# EAGLE design scematics (EAGLE 9.6.2)
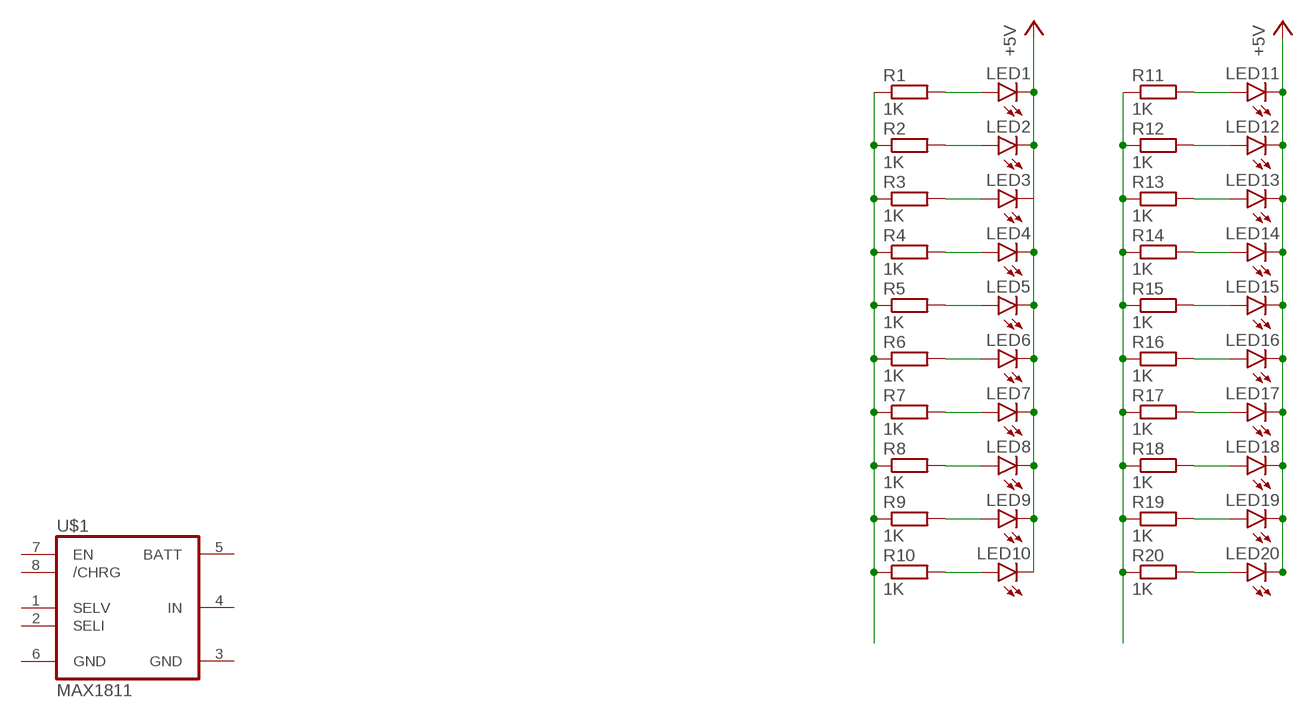
[diagram p0: schematic, sheet 1]

## Parts
LED1  LEDCHIPLED_0805  [CHIPLED_0805]
LED2  LEDCHIPLED_0805  [CHIPLED_0805]
LED3  LEDCHIPLED_0805  [CHIPLED_0805]
LED4  LEDCHIPLED_0805  [CHIPLED_0805]
LED5  LEDCHIPLED_0805  [CHIPLED_0805]
LED6  LEDCHIPLED_0805  [CHIPLED_0805]
LED7  LEDCHIPLED_0805  [CHIPLED_0805]
LED8  LEDCHIPLED_0805  [CHIPLED_0805]
LED9  LEDCHIPLED_0805  [CHIPLED_0805]
LED10  LEDCHIPLED_0805  [CHIPLED_0805]
LED11  LEDCHIPLED_0805  [CHIPLED_0805]
LED12  LEDCHIPLED_0805  [CHIPLED_0805]
LED13  LEDCHIPLED_0805  [CHIPLED_0805]
LED14  LEDCHIPLED_0805  [CHIPLED_0805]
LED15  LEDCHIPLED_0805  [CHIPLED_0805]
LED16  LEDCHIPLED_0805  [CHIPLED_0805]
LED17  LEDCHIPLED_0805  [CHIPLED_0805]
LED18  LEDCHIPLED_0805  [CHIPLED_0805]
LED19  LEDCHIPLED_0805  [CHIPLED_0805]
LED20  LEDCHIPLED_0805  [CHIPLED_0805]
R1  1K  R-EU_R0805  [R0805]
R2  1K  R-EU_R0805  [R0805]
R3  1K  R-EU_R0805  [R0805]
R4  1K  R-EU_R0805  [R0805]
R5  1K  R-EU_R0805  [R0805]
R6  1K  R-EU_R0805  [R0805]
R7  1K  R-EU_R0805  [R0805]
R8  1K  R-EU_R0805  [R0805]
R9  1K  R-EU_R0805  [R0805]
R10  1K  R-EU_R0805  [R0805]
R11  1K  R-EU_R0805  [R0805]
R12  1K  R-EU_R0805  [R0805]
R13  1K  R-EU_R0805  [R0805]
R14  1K  R-EU_R0805  [R0805]
R15  1K  R-EU_R0805  [R0805]
R16  1K  R-EU_R0805  [R0805]
R17  1K  R-EU_R0805  [R0805]
R18  1K  R-EU_R0805  [R0805]
R19  1K  R-EU_R0805  [R0805]
R20  1K  R-EU_R0805  [R0805]
U$1  MAX1811  [SO08]

## Nets
+5V: LED1.C LED2.C LED4.C LED5.C LED6.C LED7.C LED8.C LED9.C LED10.C LED11.C LED12.C LED13.C LED14.C LED15.C LED16.C LED17.C LED18.C LED19.C LED20.C
N$1: LED1.A R1.2
N$2: LED2.A R2.2
N$3: LED3.A R3.2
N$4: LED4.A R4.2
N$5: LED5.A R5.2
N$6: LED6.A R6.2
N$7: LED7.A R7.2
N$8: LED8.A R8.2
N$9: LED9.A R9.2
N$10: LED10.A R10.2
N$14: LED11.A R11.2
N$22: LED12.A R12.2
N$23: LED13.A R13.2
N$24: LED14.A R14.2
N$25: LED15.A R15.2
N$26: LED16.A R16.2
N$27: LED17.A R17.2
N$28: LED18.A R18.2
N$29: LED19.A R19.2
N$30: LED20.A R20.2
N$40: R1.1 R2.1 R3.1 R4.1 R5.1 R6.1 R7.1 R8.1 R9.1 R10.1
N$41: R11.1 R12.1 R13.1 R14.1 R15.1 R16.1 R17.1 R18.1 R19.1 R20.1
Unconnected: LED3.C U$1.1(SELV) U$1.2(SELI) U$1.5(BATT) U$1.7(EN) U$1.8(/CHRG)

## Power pins joined to a net without a drawn wire
GND: U$1.3(GND) U$1.6(GND)
IN: U$1.4(IN)

## Library data of the parts
LED1-LED20 = led:LED: LED OSRAM: - CHIPLED LG R971, LG N971, LY N971, LG Q971, LY Q971, LO R971, LY R971 LH N974, LH R974 LS Q976, LO Q976, LY Q976 LO Q996 - Hyper CHIPLED LW Q18S LB Q993, LB Q99A, LB R99A - SideLED LS A670, LO A670, LY A670, LG A670, LP A670 LB A673, LV A673, LT A673, LW A673 LH A674 LY A675 LS A676, LA A676, LO A676, LY A676, LW A676 LS A679, LY A679, LG A679 - Hyper Micro SIDELED® LS Y876, LA Y876, LO Y876, LY Y876 LT Y87S - SmartLED LW L88C, LW L88S LB L89C, LB L89S, LG L890 LS L89K, LO L89K, LY L89K LS L896, LA L896, LO L896, LY L896 - TOPLED LS T670, LO T670, LY T670, LG T670, LP T670 LSG T670, LSP T670, LSY T670, LOP T670, LYG T670 LG T671, LOG T671, LSG T671 LB T673, LV T673, LT T673, LW T673 LH T674 LS T676, LA T676, LO T676, LY T676, LB T676, LH T676, LSB T676, LW T676 LB T67C, LV T67C, LT T67C, LS T67K, LO T67K, LY T67K, LW E67C LS E67B, LA E67B, LO E67B, LY E67B, LB E67C, LV E67C, LT E67C LW T67C LS T679, LY T679, LG T679 LS T770, LO T770, LY T770, LG T770, LP T770 LB T773, LV T773, LT T773, LW T773 LH T774 LS E675, LA E675, LY E675, LS T675 LS T776, LA T776, LO T776, LY T776, LB T776 LHGB T686 LT T68C, LB T68C - Hyper Mini TOPLED® LB M676 - Mini TOPLED Santana® LG M470 LS M47K, LO M47K, LY M47K Source: http://www.osram.convergy.de LUXEON: - LUMILED® LXK2-PW12-R00, LXK2-PW12-S00, LXK2-PW14-U00, LXK2-PW14-V00 LXK2-PM12-R00, LXK2-PM12-S00, LXK2-PM14-U00 LXK2-PE12-Q00, LXK2-PE12-R00, LXK2-PE12-S00, LXK2-PE14-T00, LXK2-PE14-U00 LXK2-PB12-K00, LXK2-PB12-L00, LXK2-PB12-M00, LXK2-PB14-N00, LXK2-PB14-P00, LXK2-PB14-Q00 LXK2-PR12-L00, LXK2-PR12-M00, LXK2-PR14-Q00, LXK2-PR14-R00 LXK2-PD12-Q00, LXK2-PD12-R00, LXK2-PD12-S00 LXK2-PH12-R00, LXK2-PH12-S00 LXK2-PL12-P00, LXK2-PL12-Q00, LXK2-PL12-R00 Source: www.luxeon.com KINGBRIGHT: KA-3528ASYC Source: www.kingbright.com
R1-R20 = resistor:R-EU_: RESISTOR, European symbol
U$1 = max1811:MAX1811

## Board
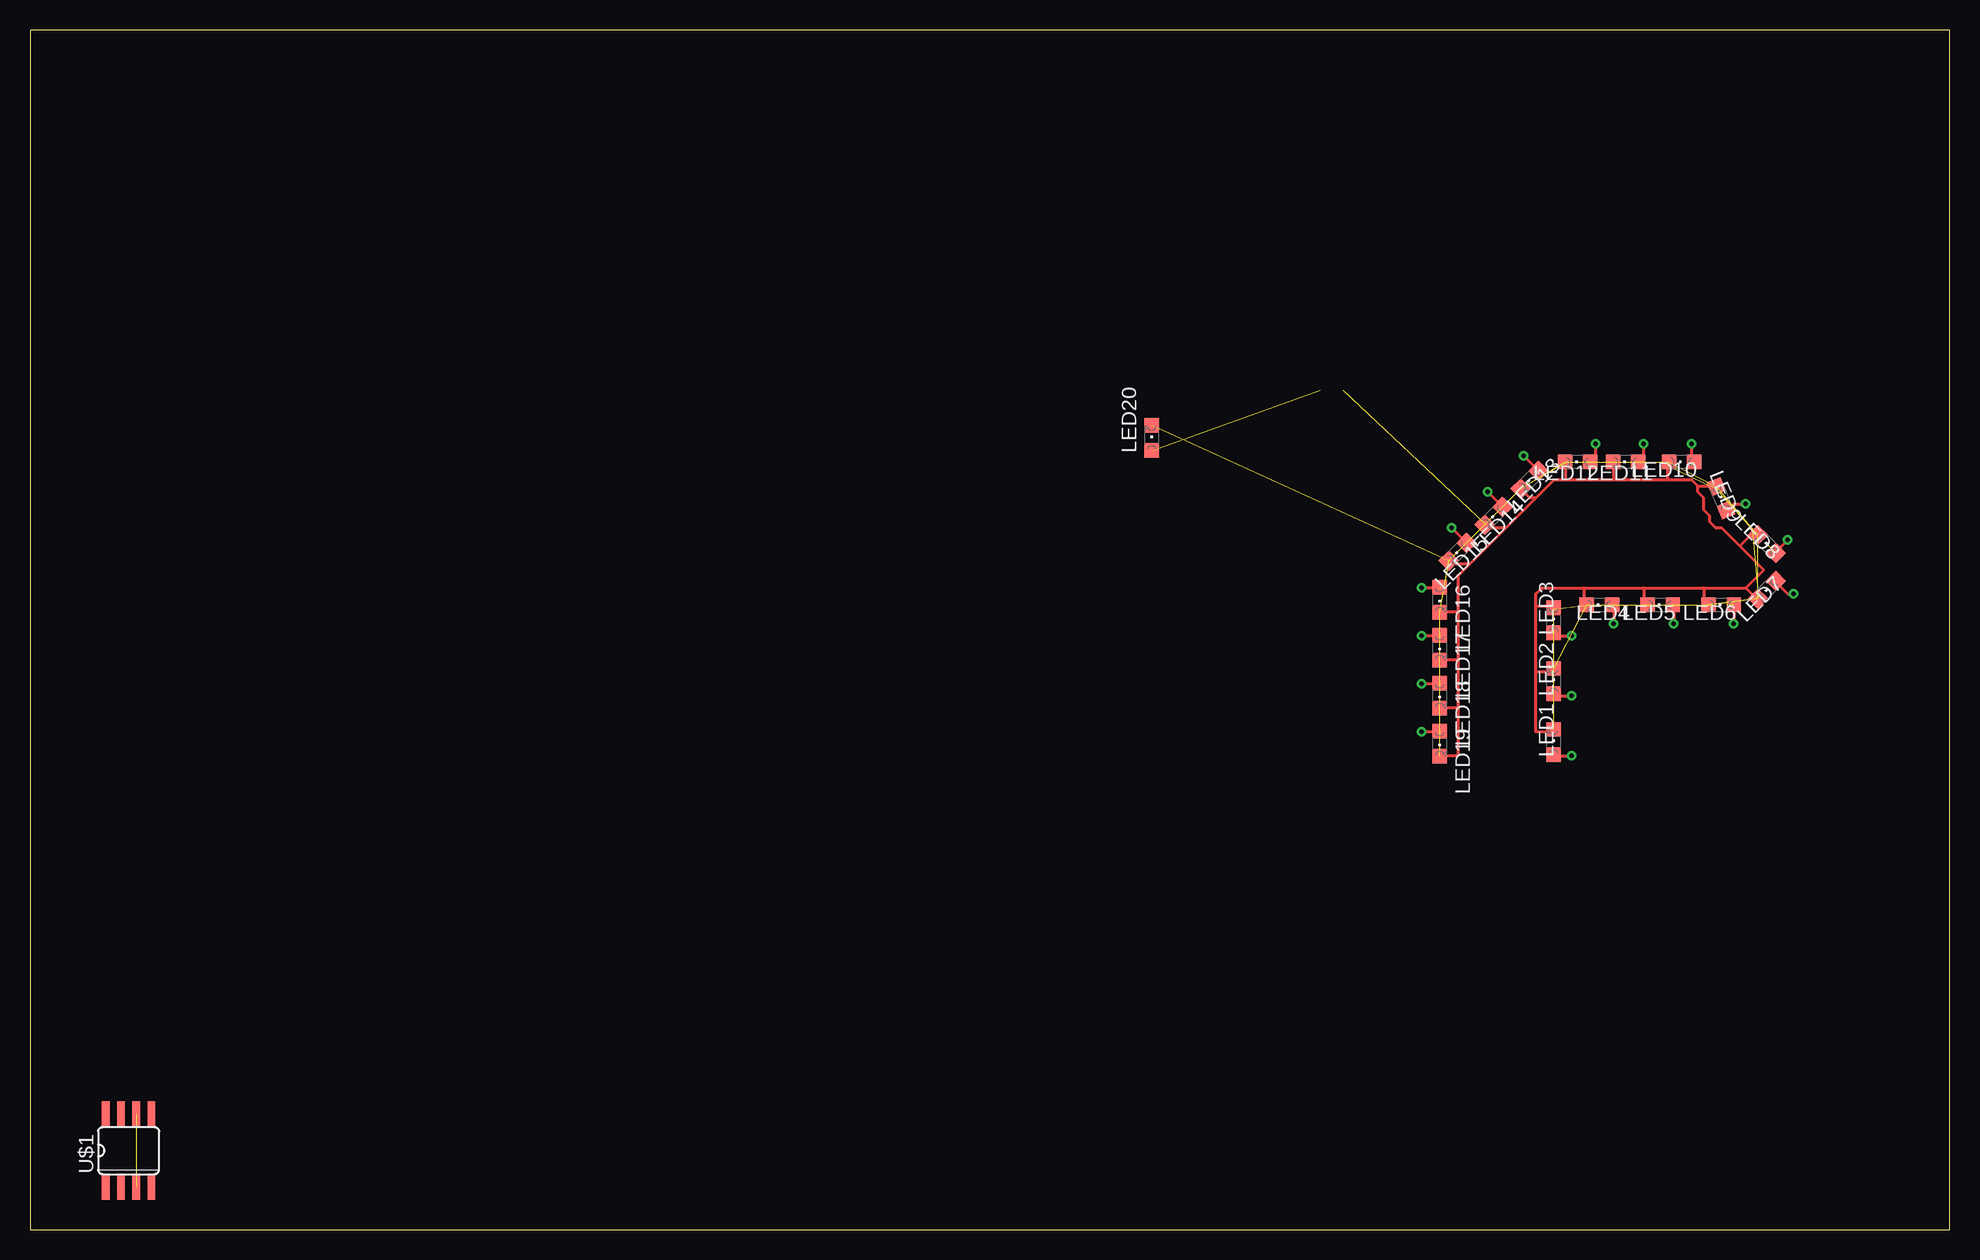
[diagram p1: board, top side]
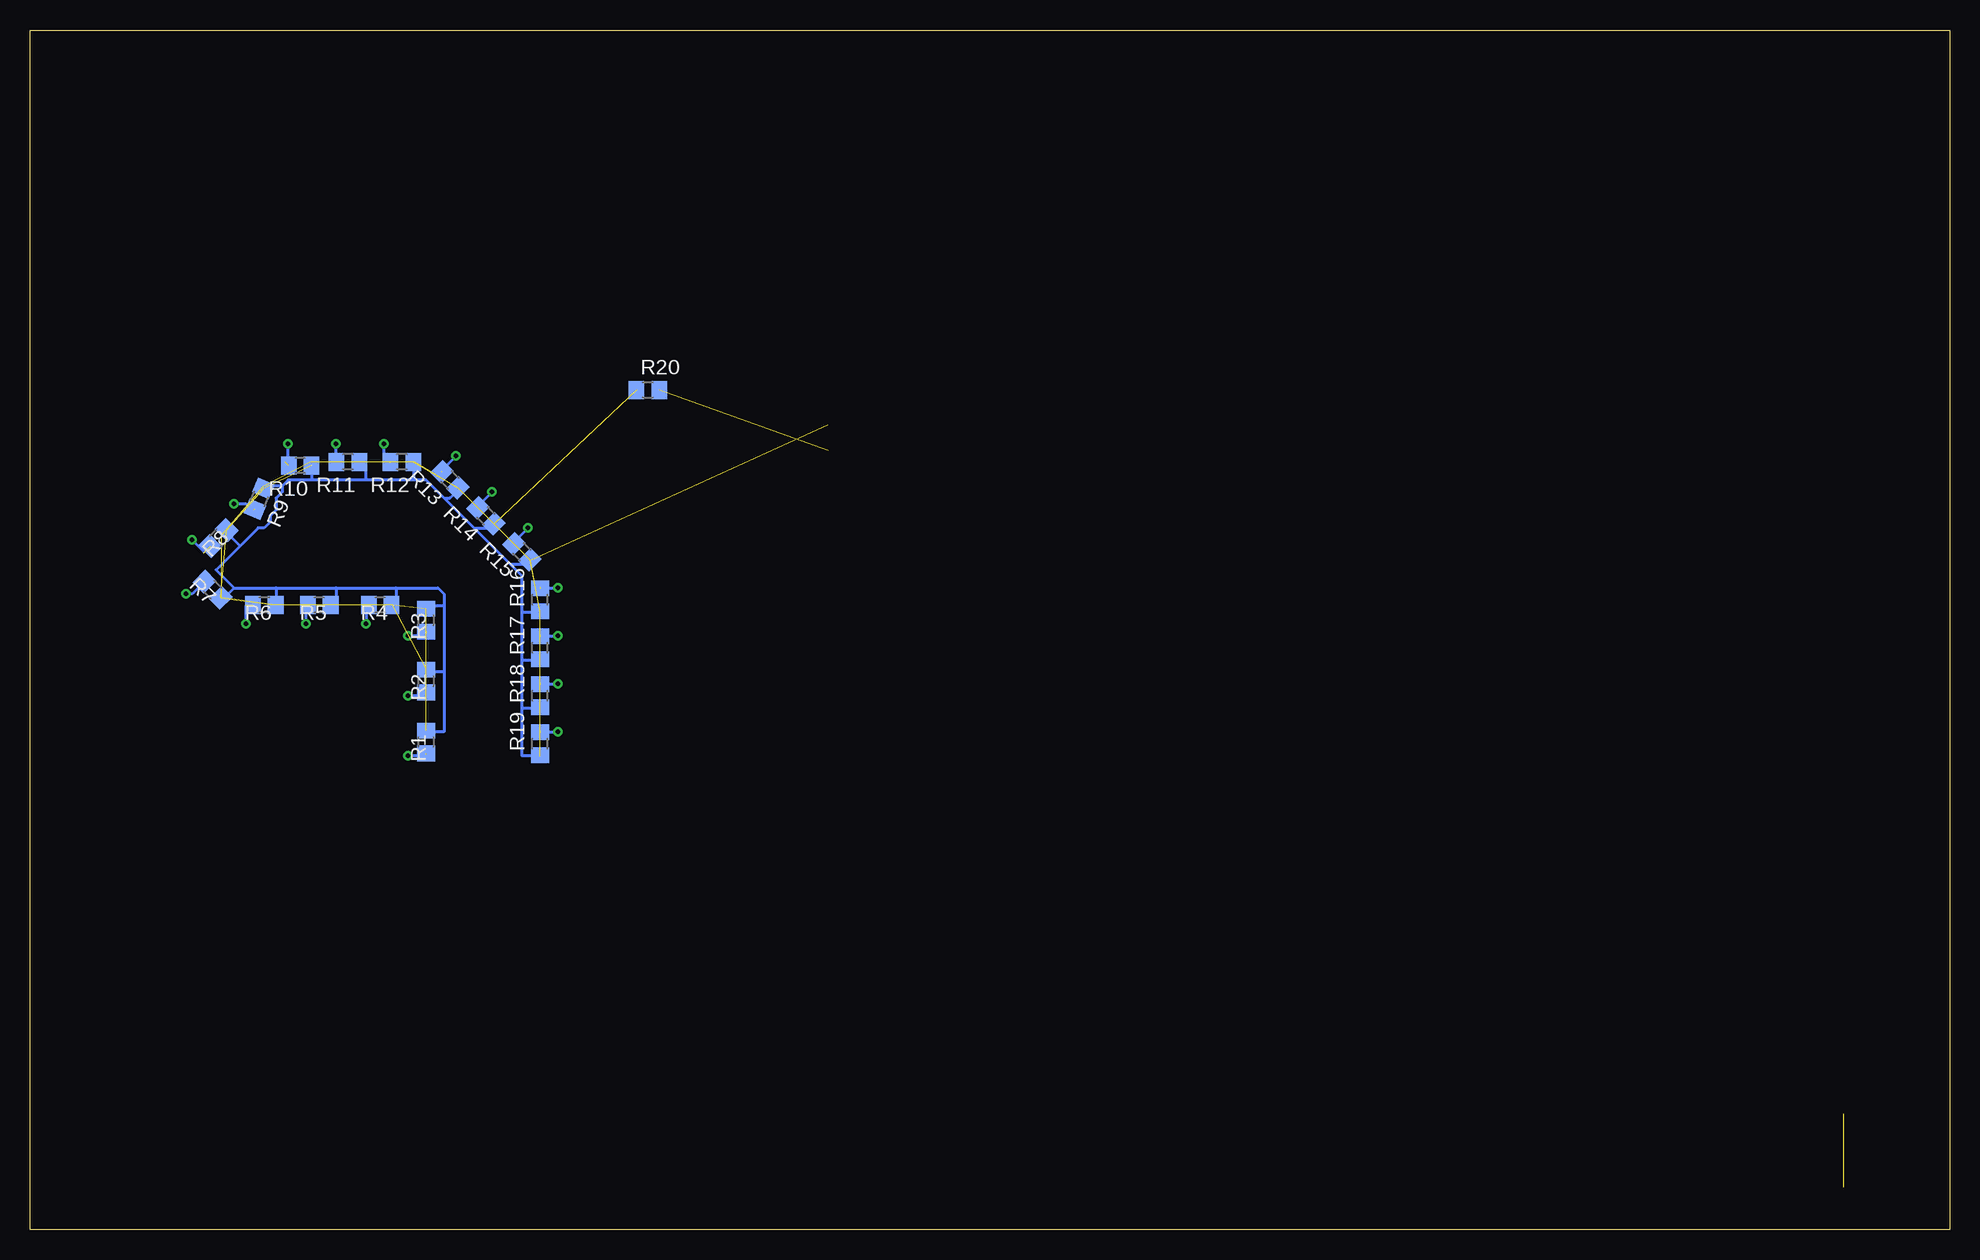
[diagram p2: board, bottom side, seen from below]

Size 160 x 100 mm. Coordinates in mm from the lower left corner, seen from the top.
Outline: 0,0 160,0 160,100 0,100 0,0
Copper layers (1*16): Top 0.035mm / dielectric 1.5mm / Bottom 0.035mm
Design rules "default": minimum track width 6mil, minimum drill 0.35mm, track to track 6mil, track to pad 6mil, pad to pad 6mil, via to via 6mil, smd to smd 6mil, copper to edge 40mil, drill to drill 6mil, minimum pad ring 10mil, minimum via ring 8mil, stop-mask expansion 4mil, vias tented up to drill 0mil, thermal gap 10mil

### Footprints (pad centres in the part's own frame; a part is rotated, then mirrored left to right if it is on the bottom)
CHIPLED_0805 = smd 1.2 x 1.2: A 0,-1.05; C 0,1.05
R0805 = smd 1.3 x 1.5: 1 -0.95,0; 2 0.95,0
SO08 = smd 0.66 x 2.032: 1 -1.905,-3.073; 2 -0.635,-3.073; 3 0.635,-3.073; 4 1.905,-3.073; 5 1.905,3.073; 6 0.635,3.073; 7 -0.635,3.073; 8 -1.905,3.073

### Placement (x,y rotation side)
LED1  127,40.64 0 top
LED2  127,45.72 0 top
LED3  127,50.8 0 top
LED4  130.81,52.07 90 top
LED5  135.89,52.07 90 top
LED6  140.97,52.07 90 top
LED7  144.78,53.34 135 top
LED8  144.78,57.15 45 top
LED9  140.97,60.96 22.5 top
LED10  137.66,64 90 top
LED11  133,64 90 top
LED12  129,64 90 top
LED13  125,62.5 135 top
LED14  122,59.5 135 top
LED15  119,56.5 135 top
LED16  117.5,52.5 180 top
LED17  117.5,48.5 180 top
LED18  117.5,44.5 180 top
LED19  117.5,40.5 180 top
LED20  93.5,66 0 top
R1  127,40.64 270 bottom
R2  127,45.72 270 bottom
R3  127,50.8 270 bottom
R4  130.81,52.07 180 bottom
R5  135.89,52.07 180 bottom
R6  140.47,52.07 180 bottom
R7  144.78,53.34 135 bottom
R8  144.28,57.65 225 bottom
R9  140.9,60.91 247.5 bottom
R10  137.48,63.69 180 bottom
R11  133.5,64 180 bottom
R12  129,64 180 bottom
R13  125,62.5 135 bottom
R14  122,59.5 135 bottom
R15  119,56.5 135 bottom
R16  117.5,52.5 90 bottom
R17  117.5,48.5 90 bottom
R18  117.5,44.5 90 bottom
R19  117.5,40.5 90 bottom
R20  108.5,70 0 bottom
U$1  8.22,6.58 0 top

### Tracks (layer width: path | path; a pad name or v marks a point on that pad's centre or on a via)
+5V  (18 unrouted)
GND  (1 unrouted)
N$1  (1 unrouted)
N$2  (1 unrouted)
N$3  (1 unrouted)
N$4  (1 unrouted)
N$5  (1 unrouted)
N$6  (1 unrouted)
N$7  (1 unrouted)
N$8  (1 unrouted)
N$9  (1 unrouted)
N$10  (1 unrouted)
N$11  (via drill 0.35)
  Top 0.254: 138.5,63.5 v138.5,65.5
  Bottom 0.254: 138,63.5 138.5,64 v138.5,65.5
N$12  (via drill 0.35)
  Top 0.254: 141.5,60 142,60.5 v143,60.5
  Bottom 0.254: 141.5,60 142,60.5 v143,60.5
N$13  (via drill 0.35)
  Top 0.254: 145.5,56.5 v146.5,57.5
  Bottom 0.254: 145.5,56.5 v146.5,57.5
N$14  (1 unrouted)
N$15  (via drill 0.35)
  Top 0.254: 142,52 v142,50.5
  Bottom 0.254: v142,50.5 142,52
N$16  (via drill 0.35)
  Top 0.254: 137,52 v137,50.5
  Bottom 0.254: v137,50.5 137,52
N$17  (via drill 0.35)
  Top 0.254: 132,52 v132,50.5
  Bottom 0.254: v132,50.5 132,52 131.5,52
N$18  (via drill 0.35)
  Top 0.254: 127,49.5 v128.5,49.5
  Bottom 0.254: 127,49.5 v128.5,49.5
N$19  (via drill 0.35)
  Top 0.254: 127,44.5 v128.5,44.5
  Bottom 0.254: 127,44.5 v128.5,44.5
N$20  (via drill 0.35)
  Top 0.254: 127,39.5 v128.5,39.5
  Bottom 0.254: 127,39.5 v128.5,39.5
N$21  (via drill 0.35)
  Top 0.254: 145.5,54 146.5,53 v147,53
  Bottom 0.254: 145.5,54 146.5,53 v147,53
N$22  (1 unrouted)
N$23  (1 unrouted)
N$24  (1 unrouted)
N$25  (1 unrouted)
N$26  (1 unrouted)
N$27  (1 unrouted)
N$28  (1 unrouted)
N$29  (1 unrouted)
N$30  (1 unrouted)
N$31  (via drill 0.35)
  Top 0.254: 134.5,64 v134.5,65.5
  Bottom 0.254: 134.5,64 v134.5,65.5
N$32  (via drill 0.35)
  Top 0.254: 130.5,64 v130.5,65.5
  Bottom 0.254: 130.5,64 v130.5,65.5
N$33  (via drill 0.35)
  Top 0.254: 125.5,63.5 v124.5,64.5
  Bottom 0.254: 125.5,63.5 v124.5,64.5
N$34  (via drill 0.35)
  Top 0.254: 122.5,60.5 v121.5,61.5
  Bottom 0.254: 122.5,60.5 v121.5,61.5
N$35  (via drill 0.35)
  Top 0.254: 119.5,57.5 v118.5,58.5
  Bottom 0.254: 119.5,57.5 v118.5,58.5
N$36  (via drill 0.35)
  Top 0.254: 117.5,53.5 v116,53.5
  Bottom 0.254: 117.5,53.5 v116,53.5
N$37  (via drill 0.35)
  Top 0.254: 117.5,49.5 v116,49.5
  Bottom 0.254: 117.5,49.5 v116,49.5
N$38  (via drill 0.35)
  Top 0.254: 117.5,45.5 v116,45.5
  Bottom 0.254: 117.5,45.5 v116,45.5
N$39  (via drill 0.35)
  Top 0.254: 117.5,41.5 v116,41.5
  Bottom 0.254: 117.5,41.5 v116,41.5
N$40  (9 unrouted)
N$41  (9 unrouted)
N$42
  Top 0.254: 127,41.5 125.5,41.5 125.5,46.5 | 127,46.5 125.5,46.5 | 125.5,46.5 125.5,52 | 125.5,52 127,52 | 125.5,52 125.5,53 126,53.5 129.5,53.5 | 129.5,53.5 134.5,53.5 | 134.5,53.5 139.5,53.5 | 139.5,53.5 143,53.5 | 143,53.5 144.5,55 142.5,57 | 142.5,57 143.5,58 | 142.5,57 141,58.5 140.5,58.5 140,59 140,59.5 139.5,60 139.5,61 139,61.5 139,62 | 139,62 140,62 | 139,62 138.5,62.5 136.5,62.5 | 136.5,62.5 136.5,63.5 | 136.5,62.5 132,62.5 | 132,62.5 132,63.5 | 132,62.5 128,62.5 | 128,62.5 128,63.5 | 128,62.5 127,62.5 125.5,61 | 125.5,61 125,61 124.5,61.5 | 125.5,61 123,58.5 | 123,58.5 121,58.5 | 123,58.5 120,55.5 | 120,55.5 118.5,55.5 | 120,55.5 119,54.5 119,51.5 | 119,51.5 118,51.5 | 119,51.5 119,47.5 | 119,47.5 118,47.5 | 119,47.5 119,43.5 | 119,43.5 118,43.5 | 119,43.5 119,39.5 118,39.5 | 129.5,53.5 129.5,52.5 | 134.5,53.5 134.5,52.5 | 139.5,53.5 139.5,52.5 | 143,53.5 144,52.5
N$43
  Bottom 0.254: 117.5,39.5 119,39.5 119,43.5 | 119,43.5 118,43.5 | 119,43.5 119,47.5 | 119,47.5 118,47.5 | 119,47.5 119,51.5 | 119,51.5 118,51.5 | 119,51.5 119,54.5 120,55.5 | 120,55.5 118.5,55.5 | 120,55.5 123,58.5 | 123,58.5 121,58.5 | 123,58.5 125.5,61 | 125.5,61 125,61 124.5,61.5 | 125.5,61 127,62.5 128,62.5 | 128,62.5 128,63.5 | 128,62.5 132,62.5 | 132,62.5 132,63.5 | 132,62.5 136.5,62.5 | 136.5,62.5 136.5,63.5 | 136.5,62.5 138.5,62.5 139,62 | 139,62 140,62 | 139,62 139,61.5 139.5,61 139.5,60 140,59.5 140,59 140.5,58.5 141,58.5 142.5,57 | 142.5,57 143.5,58 | 142.5,57 144.5,55 143,53.5 | 143,53.5 139.5,53.5 | 139.5,53.5 134.5,53.5 | 134.5,53.5 129.5,53.5 | 129.5,53.5 126,53.5 125.5,53 125.5,52 | 125.5,52 127,52 | 125.5,52 125.5,46.5 | 125.5,46.5 127,46.5 | 125.5,46.5 125.5,41.5 127,41.5 | 129.5,53.5 129.5,52.5 | 134.5,53.5 134.5,52.5 | 139.5,53.5 139.5,52.5 | 143,53.5 144,52.5